# Altium project OK6010_DB.PrjPcb (part 2 of 2)

## Sheet OK6010_DB_DAC_f.SchDoc
size 260 x 195 mm; PageSetup: Record=PageOptions|CenterHorizontal=True|CenterVertical=True|PrintScale=1.02|XCorrection=1.00|YCorrection=1.00|PrintKind=2|BorderSize=5000000|LeftOffset=0|BottomOffset=0|Orientation=2|PaperLength=1000|PaperWidth=1000|Scale=100|PaperSource=15|PrintQuality=600|MediaType=1|DitherType=10|PaperKind=Letter|PrintScaleMode=1
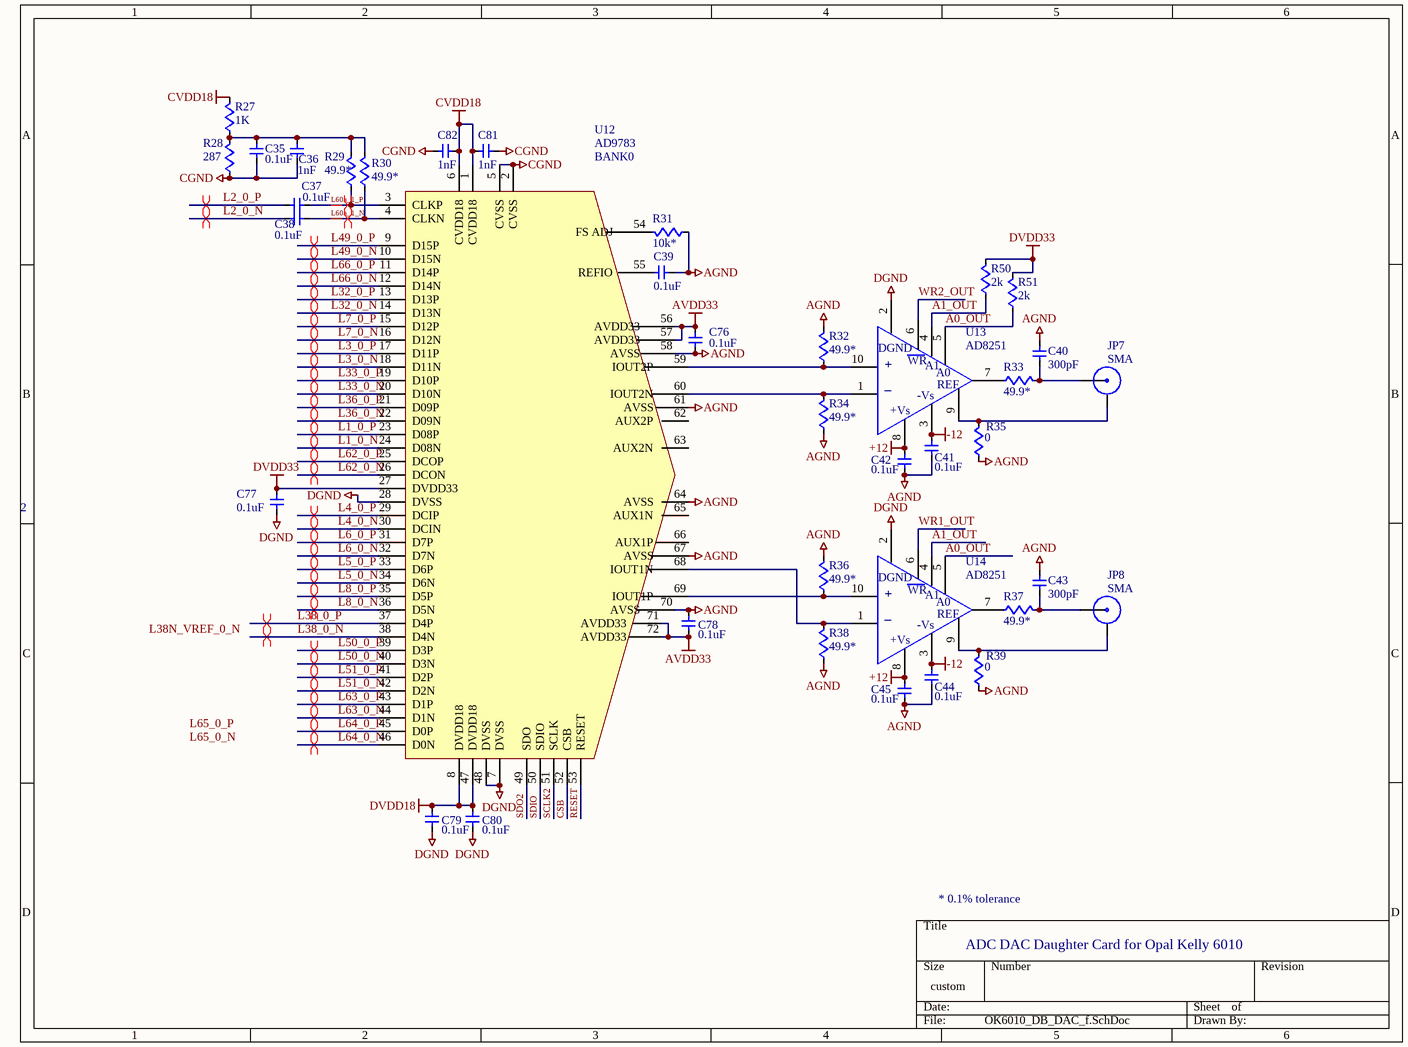
[diagram p3: OK6010_DB_DAC_f.SchDoc]

### Parts
C35  0.1uF  [0603w]
C36  1nF  [0603w]
C37  0.1uF  [1206]
C38  0.1uF  [1206]
C39  0.1uF  [0603w]
C40  300pF  [0603w]
C41  0.1uF  [0603w]
C42  0.1uF  [0603w]
C43  300pF  [0603w]
C44  0.1uF  [0603w]
C45  0.1uF  [0603w]
C76  0.1uF  [0603w]
C77  0.1uF  [0603w]
C78  0.1uF  [0603w]
C79  0.1uF  [0603w]
C80  0.1uF  [0603w]
C81  1nF  [0603w]
C82  1nF  [0603w]
JP7  SMA  [sma_pcb_200]
JP8  SMA  [sma_pcb_200]
R27  1K  [0603w]
R28  287  [0603w]
R29  49.9*  [0603w]
R30  49.9*  [0603w]
R31  10k*  [0603w]
R32  49.9*  [0603w]
R33  49.9*  [0603w]
R34  49.9*  [0603w]
R35  0  [0603w]
R36  49.9*  [0603w]
R37  49.9*  [0603w]
R38  49.9*  [0603w]
R39  0  [0603w]
R50  2k  [0603w]
R51  2k  [0603w]
U12  AD9783  [LFCSP72]
U13  AD8251  [MSOP10sm]
U14  AD8251  [MSOP10sm]

### Nets
+12: C42.2 C45.2 U13.8 U14.8
-12: C41.2 C44.2 U13.3 U14.3
AGND: C35.2 C36.2 C39.2 C40.2 C41.1 C42.1 C43.2 C44.1 C45.1 C76.1 C77.2 C78.2 C79.1 C80.1 C81.2 C82.2 R28.1 R31.1 R32.2 R34.1 R35.1 R36.2 R38.1 R39.1 U12.2(CVSS) U12.5(CVSS) U12.7(DVSS) U12.28(DVSS) U12.48(DVSS) U12.58(AVSS) U12.61(AVSS) U12.64(AVSS) U12.67(AVSS) U12.70(AVSS) U13.2 U14.2  [also labelled CGND, DGND]
AVDD33: C76.2 C78.1 U12.56(AVDD33) U12.57(AVDD33) U12.71(AVDD33) U12.72(AVDD33)
CVDD18: C81.1 C82.1 R27.2 U12.1(CVDD18) U12.6(CVDD18)
DVDD18: C79.2 C80.2 U12.8(DVDD18) U12.47(DVDD18)
DVDD33: C77.1 R50.2 R51.2 U12.27(DVDD33)
A0_OUT: R51.1 U13.5 U14.5
A1_OUT: R50.1 U13.4 U14.4
CSB: U12.52(CSB)
L1_0_N: U12.24(D08N)
L1_0_P: U12.23(D08P)
L2_0_N: C38.1
L2_0_P: C37.1
L3_0_N: U12.18(D11N)
L3_0_P: U12.17(D11P)
L4_0_N: U12.30(DCIN)
L4_0_P: U12.29(DCIP)
L5_0_N: U12.34(D6N)
L5_0_P: U12.33(D6P)
L6_0_N: U12.32(D7N)
L6_0_P: U12.31(D7P)
L7_0_N: U12.16(D12N)
L7_0_P: U12.15(D12P)
L8_0_N: U12.36(D5N)
L8_0_P: U12.35(D5P)
L32_0_N: U12.14(D13N)
L32_0_P: U12.13(D13P)
L33_0_N: U12.20(D10N)
L33_0_P: U12.19(D10P)
L36_0_N: U12.22(D09N)
L36_0_P: U12.21(D09P)
L38_0_N: U12.38(D4N)
L38_0_P: U12.37(D4P)
L49_0_N: U12.10(D15N)
L49_0_P: U12.9(D15P)
L50_0_N: U12.40(D3N)
L50_0_P: U12.39(D3P)
L51_0_N: U12.42(D2N)
L51_0_P: U12.41(D2P)
L60a_1_N: C38.2 R30.1 U12.4(CLKN)
L60a_1_P: C37.2 R29.1 U12.3(CLKP)
L62_0_N: U12.26(DCON)
L62_0_P: U12.25(DCOP)
L63_0_N: U12.44(D1N)
L63_0_P: U12.43(D1P)
L64_0_N: U12.46(D0N)
L64_0_P: U12.45(D0P)
L66_0_N: U12.12(D14N)
L66_0_P: U12.11(D14P)
RESET: U12.53(RESET)
SCLK2: U12.51(SCLK)
SDIO: U12.50(SDIO)
SDO2: U12.49(SDO)
WR1_OUT: U14.6
WR2_OUT: U13.6
NetC35_1: C35.1 C36.1 R27.1 R28.2 R29.2 R30.2
NetC39_1: C39.1 U12.55(REFIO)
NetC40_1: C40.1 JP7.1(signal) R33.2
NetC43_1: C43.1 JP8.1(signal) R37.2
NetJP7_0: JP7.0(ground) R35.2 U13.9
NetJP8_0: JP8.0(ground) R39.2 U14.9
NetR31_2: R31.2 U12.54(FS_ADJ)
NetR32_1: R32.1 U12.59(IOUT2P) U13.10
NetR33_1: R33.1 U13.7
NetR34_2: R34.2 U12.60(IOUT2N) U13.1
NetR36_1: R36.1 U12.69(IOUT1P) U14.10
NetR37_1: R37.1 U14.7
NetR38_2: R38.2 U12.68(IOUT1N) U14.1

Not connected (* = marked no-connect by the designer): U12 62(AUX2P) 63(AUX2N) 65(AUX1N) 66(AUX1P)

### Layout directives
differential pair: L1_0_N, L1_0_P, L2_0_N, L2_0_P, L3_0_N, L3_0_P, L4_0_N, L4_0_P, L5_0_N, L5_0_P, L6_0_N, L6_0_P, L7_0_N, L7_0_P, L8_0_N, L8_0_P, L32_0_N, L32_0_P, L33_0_N, L33_0_P, L36_0_N, L36_0_P, L38_0_N, L38_0_P, L49_0_N, L49_0_P, L50_0_N, L50_0_P, L51_0_N, L51_0_P, L60a_1_N, L60a_1_P, L62_0_N, L62_0_P, L63_0_N, L63_0_P, L64_0_N, L64_0_P, L66_0_N, L66_0_P

### Notes on the sheet
- (near U12) BANK0
- 2
- * 0.1% tolerance
- ADC DAC Daughter Card for Opal Kelly 6010
- Labels drawn without touching a wire or pin: L38N_VREF_0_N, L65_0_N, L65_0_P
- (in symbol AD8251) DGND; WR; +; A1; A0; _; REF; -Vs; +Vs

### Library data of the parts
C35 C39 C41 C42 C44 C45 C76-C80 = CAP_SM_1: capacitor; Manufacturer: Kemet; Manufacturer Part Number: C0603C104K3RACTU; Capacitance: 0.1µF; Temperature Coefficient: X7R; Tolerance: ±10%; Voltage - Rated: 25V; Applications: General Purpose; Category: Capacitors; ComponentLink1Description: http://www.kemet.com/datasheets&C0603C104K3RACTU; ComponentLink1URL: http://www.kemet.com/datasheets&C0603C104K3RACTU; Features: -; Lead Spacing: -; Lead Style: -; Mounting Type: Surface Mount, MLCC; Operating Temperature: -55°C ~ 125°C; Package / Case: 0603 (1608 Metric); Packaging: Cut Tape (CT); Pricing 1: 10=0.075, 100=0.027, 250=0.01952, 500=0.0144, 1000=0.00975 (USD); Ratings: -; RoHS: RoHS Compliant; Size / Dimension: 0.063" L x 0.032" W (1.60mm x 0.80mm); Stock 1: 2338960; Supplier 1: Digi-Key; Supplier Part Number 1: 399-1281-1-ND; Thickness: 0.80mm
C36 C81 C82 = CAP_SM_1: capacitor; Manufacturer: Murata Electronics North America; Manufacturer Part Number: GRM188R71H102KA01D; Description: CAP CER 1000PF 50V 10% X7R 0603; Capacitance: 1000pF; Voltage - Rated: 50V; Tolerance: ±10%; Temperature Coefficient: X7R; Supplier 1: Digi-Key; Supplier Part Number 1: 490-1494-1-ND; RoHS: RoHS Compliant; Category: Capacitors; Stock 1: 512721; Pricing 1: 1=0.07, 10=0.043, 50=0.0204, 100=0.0153, 250=0.01104, 500=0.00816, 1000=0.00553 (USD); Mounting Type: Surface Mount, MLCC; Operating Temperature: -55°C ~ 125°C; Applications: General Purpose; Ratings: -; Package / Case: 0603 (1608 Metric); Size / Dimension: 0.063" L x 0.031" W (1.60mm x 0.80mm); Height: -; Thickness: 0.035" (0.90mm); Lead Spacing: -; Features: -; Packaging: Cut Tape (CT); Lead Style: -; ComponentLink1URL: http://search.murata.co.jp/Ceramy/image/img/PDF/ENG/GRM188R71H102KA01.pdf; ComponentLink1Description: http://search.murata.co.jp/Ceramy/image/img/PDF/ENG/GRM188R71H102KA01.pdf
C37 C38 = CAP_SM_1: capacitor; Manufacturer: Murata Electronics North America; Manufacturer Part Number: GRM31C5C1E104JA01L; Description: CAP CER .1UF 25V 5% C0G 1206; Capacitance: 0.1µF; Voltage - Rated: 25V; Tolerance: ±5%; Temperature Coefficient: C0G, NP0; Supplier 1: Digi-Key; Supplier Part Number 1: 490-1767-1-ND; RoHS: RoHS Compliant; Category: Capacitors; Stock 1: 374793; Pricing 1: 1=0.57, 10=0.48, 50=0.3436, 100=0.3007, 250=0.23628, 500=0.2148, 1000=0.17184 (USD); Mounting Type: Surface Mount, MLCC; Operating Temperature: -55°C ~ 125°C; Applications: General Purpose; Ratings: -; Package / Case: 1206 (3216 Metric); Size / Dimension: 0.126" L x 0.063" W (3.20mm x 1.60mm); Height: -; Thickness: 0.071" (1.80mm); Lead Spacing: -; Features: -; Packaging: Cut Tape (CT); Lead Style: -; ComponentLink1URL: http://search.murata.co.jp/Ceramy/image/img/PDF/ENG/GRM31C5C1E104JA01.pdf; ComponentLink1Description: http://search.murata.co.jp/Ceramy/image/img/PDF/ENG/GRM31C5C1E104JA01.pdf
C40 C43 = CAP_SM_1: capacitor; Supplier 1: Digi-Key; Supplier Part Number 1: 490-1438-1-ND
JP7 = SMA_EDGE: sma connector; Manufacturer: TE Connectivity; Manufacturer Part Number: 5-1814832-1; Description: CONN SOCKET SMA STR DIE CAST PCB; Connector Type: Jack, Female Sockets; Contact Termination: Solder; Impedance: 50 Ohm; Frequency - Max: 3GHz; Supplier 1: Digi-Key; Supplier Part Number 1: A97594-ND; RoHS: RoHS Compliant; Category: Connectors, Interconnects; Stock 1: 22563; Pricing 1: 1=2.7, 25=2.322, 50=2.052, 100=1.836, 250=1.62, 500=1.4364 (USD); Connector Style: SMA; Mounting Type: Through Hole; Fastening Type: Threaded; Cable Group: -; Features: -; Color: -; Packaging: Bulk; ComponentLink1URL: http://documents.tycoelectronics.com/commerce/DocumentDelivery/DDEController?Action=srchrtrv&DocNm=1814832&DocType=CD&DocLang=EN; ComponentLink1Description: http://documents.tycoelectronics.com/commerce/DocumentDelivery/DDEController?Action=srchrtrv&DocNm=1814832&DocType=CD&DocLang=EN
JP8 = SMA_EDGE: sma connector; Manufacturer: TE Connectivity; Manufacturer Part Number: 5-1814832-1; Connector Type: Jack, Female Sockets; Contact Termination: Solder; Frequency - Max: 3GHz; Impedance: 50 Ohm; Cable Group: -; Category: Connectors, Interconnects; Color: -; ComponentLink1Description: http://documents.tycoelectronics.com/commerce/DocumentDelivery/DDEController?Action=srchrtrv&DocNm=1814832&DocType=CD&DocLang=EN; ComponentLink1URL: http://documents.tycoelectronics.com/commerce/DocumentDelivery/DDEController?Action=srchrtrv&DocNm=1814832&DocType=CD&DocLang=EN; Connector Style: SMA; Fastening Type: Threaded; Features: -; Mounting Type: Through Hole; Packaging: Bulk; Pricing 1: 1=2.7, 25=2.322, 50=2.052, 100=1.836, 250=1.62, 500=1.4364 (USD); RoHS: RoHS Compliant; Stock 1: 22563; Supplier 1: Digi-Key; Supplier Part Number 1: A97594-ND
R27 = RES_SM: resistor; Manufacturer: Yageo; Manufacturer Part Number: RC0603FR-071KL; Description: RES 1.00K OHM 1/10W 1% 0603 SMD; Power (Watts): 0.1W, 1/10W; Temperature Coefficient: ±100ppm/°C; Tolerance: ±1%; Supplier 1: Digi-Key; Supplier Part Number 1: 311-1.00KHRCT-ND; RoHS: RoHS Compliant; Category: Resistors; Stock 1: 4416298; Pricing 1: 10=0.014, 50=0.0104, 100=0.0079, 250=0.00584, 500=0.00432, 1000=0.00288 (USD); Resistance (Ohms): 1K; Composition: Thick Film; Features: -; Size / Dimension: 0.063" L x 0.031" W (1.60mm x 0.80mm); Height: 0.018" (0.45mm); Number of Terminations: 2; Packaging: Cut Tape (CT); Package / Case: 0603 (1608 Metric); ComponentLink1URL: http://www.yageo.com/documents/recent/PYu-RC0603_51_RoHS_L_4.pdf; ComponentLink1Description: http://www.yageo.com/documents/recent/PYu-RC0603_51_RoHS_L_4.pdf
R28 = RES_SM: resistor; Manufacturer: Yageo; Manufacturer Part Number: RC0603FR-07287RL; Description: RES 287 OHM 1/10W 1% 0603 SMD; Power (Watts): 0.1W, 1/10W; Temperature Coefficient: ±100ppm/°C; Tolerance: ±1%; Supplier 1: Digi-Key; Supplier Part Number 1: 311-287HRCT-ND; RoHS: RoHS Compliant; Category: Resistors; Stock 1: 82528; Pricing 1: 10=0.014, 50=0.0104, 100=0.0079, 250=0.00584, 500=0.00432, 1000=0.00288 (USD); Resistance (Ohms): 287; Composition: Thick Film; Features: -; Size / Dimension: 0.063" L x 0.031" W (1.60mm x 0.80mm); Height: 0.018" (0.45mm); Number of Terminations: 2; Packaging: Cut Tape (CT); Package / Case: 0603 (1608 Metric); ComponentLink1URL: http://www.yageo.com/documents/recent/PYu-RC0603_51_RoHS_L_4.pdf; ComponentLink1Description: http://www.yageo.com/documents/recent/PYu-RC0603_51_RoHS_L_4.pdf
R29 R30 R32-R34 R36-R38 = RES_SM: resistor; Manufacturer: Stackpole Electronics Inc; Manufacturer Part Number: RNCS0603BKE49R9; Description: RES 1/16W 49.9 OHM 0.1% 0603; Resistance (Ohms): 49.9; Power (Watts): 0.063W, 1/16W; Temperature Coefficient: ±25ppm/°C; Tolerance: ±0.1%; Supplier 1: Digi-Key; Supplier Part Number 1: RNCS0603BKE49R9CT-ND; RoHS: RoHS Compliant; Category: Resistors; Stock 1: 13782; Pricing 1: 1=0.7, 10=0.475, 50=0.2876, 100=0.2375, 250=0.18752, 500=0.16 (USD); Composition: Thin Film; Features: Anti-Corrosive, Moisture Resistant; Size / Dimension: 0.061" L x 0.031" W (1.55mm x 0.80mm); Height: 0.018" (0.45mm); Number of Terminations: 2; Packaging: Cut Tape (CT); Package / Case: 0603 (1608 Metric); ComponentLink1URL: http://www.seielect.com/Catalog/SEI-rncs.pdf; ComponentLink1Description: http://www.seielect.com/Catalog/SEI-rncs.pdf
R31 = RES_SM: resistor; Manufacturer: Susumu; Manufacturer Part Number: RG1608P-103-B-T5; Description: RES 10.0K OHM 1/10W .1% 0603 SMD; Resistance (Ohms): 10K; Power (Watts): 0.1W, 1/10W; Temperature Coefficient: ±25ppm/°C; Tolerance: ±0.1%; Supplier 1: Digi-Key; Supplier Part Number 1: RG16P10.0KBCT-ND; RoHS: RoHS Compliant; Category: Resistors; Stock 1: 368390; Pricing 1: 10=0.409, 50=0.2478, 200=0.2047, 1000=0.10342 (USD); Composition: Thin Film; Features: -; Size / Dimension: 0.063" L x 0.031" W (1.60mm x 0.80mm); Height: 0.016" (0.40mm); Number of Terminations: 2; Packaging: Cut Tape (CT); Package / Case: 0603 (1608 Metric); ComponentLink1URL: http://www.susumu-usa.com/pdf/RG_RM_RGH_DATASHEET.pdf; ComponentLink1Description: http://www.susumu-usa.com/pdf/RG_RM_RGH_DATASHEET.pdf
R35 R39 = RES_SM: resistor; Supplier 1: Digi-Key; Supplier Part Number 1: P0.0GCT-ND
R50 R51 = RES_SM: resistor; Manufacturer: Yageo; Manufacturer Part Number: RC0603FR-072KL; Power (Watts): 0.1W, 1/10W; Temperature Coefficient: ±100ppm/°C; Tolerance: ±1%; Description: RES 2.00K OHM 1/10W 1% 0603 SMD; Category: Resistors; ComponentLink1Description: http://www.yageo.com/documents/recent/PYu-RC0603_51_RoHS_L_4.pdf; ComponentLink1URL: http://www.yageo.com/documents/recent/PYu-RC0603_51_RoHS_L_4.pdf; Composition: Thick Film; Features: -; Height: 0.018" (0.45mm); Number of Terminations: 2; Package / Case: 0603 (1608 Metric); Packaging: Cut Tape (CT); Pricing 1: 10=0.014, 50=0.0104, 100=0.0079, 250=0.00584, 500=0.00432, 1000=0.00288 (USD); Resistance (Ohms): 2K; RoHS: RoHS Compliant; Size / Dimension: 0.063" L x 0.031" W (1.60mm x 0.80mm); Stock 1: 1129886; Supplier 1: Digi-Key; Supplier Part Number 1: 311-2.00KHRCT-ND
U12 = AD9783: DAC LVDS DUAL16BIT 500MSPS; Supplier 1: Digi-Key; Supplier Part Number 1: AD9783BCPZ-ND
U13 U14 = AD8251: IC AMP INST ICMOS LDRIFT 10MSOP; Supplier 1: Digi-Key; Supplier Part Number 1: AD8251ARMZ-ND

## Sheet OK6010_DB_PWR.SchDoc
size 260 x 195 mm
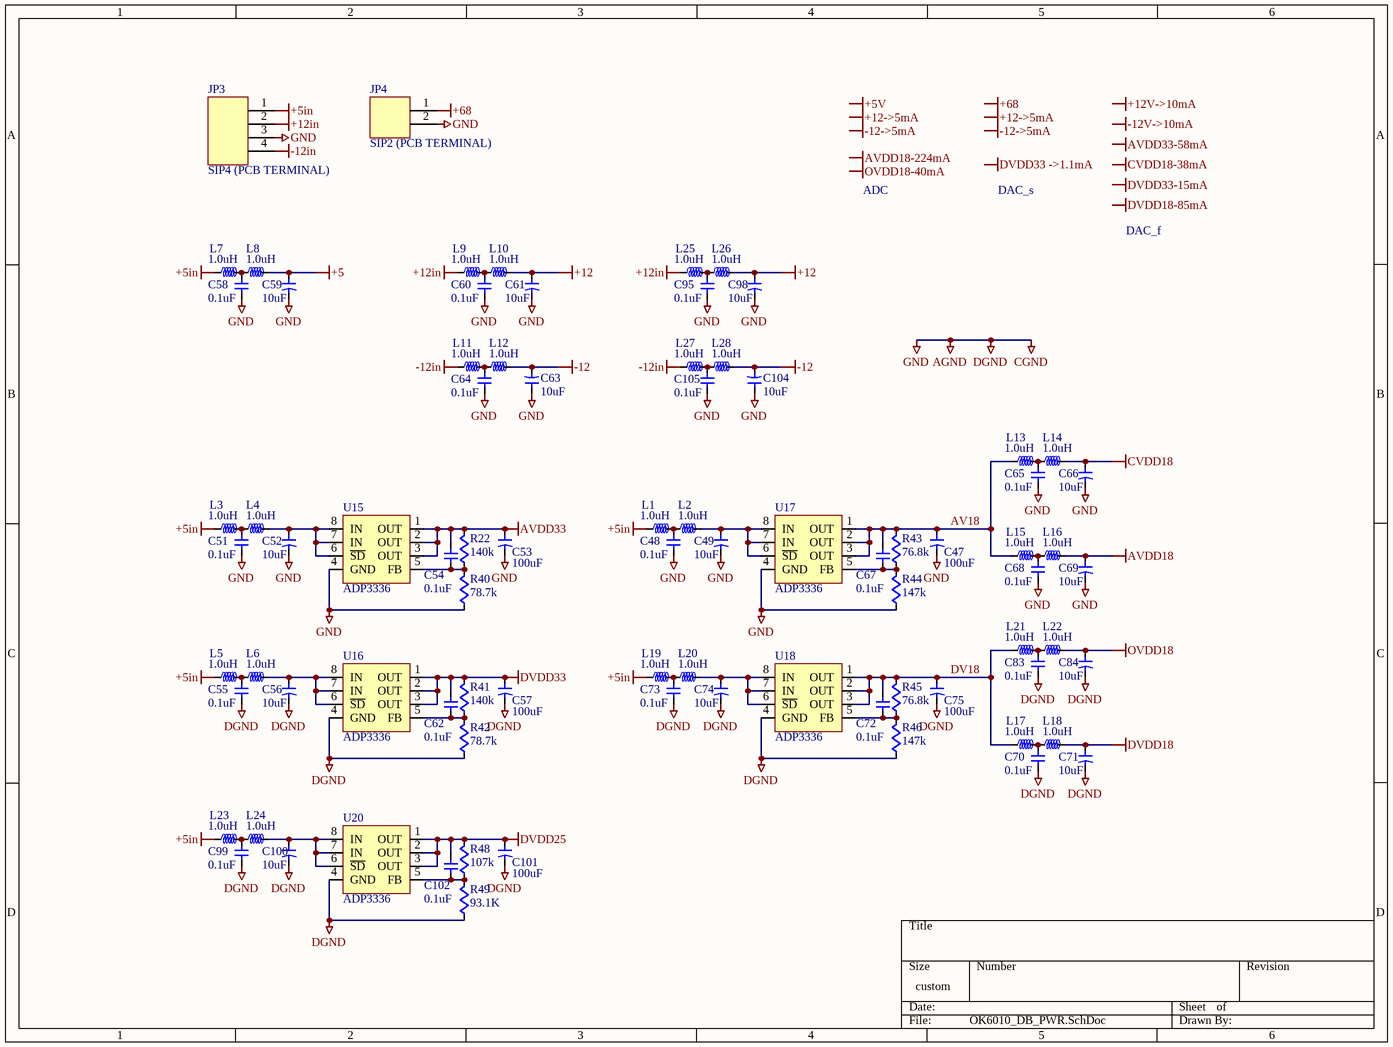
[diagram p4: OK6010_DB_PWR.SchDoc]

### Parts
C47  100uF  [1206]
C48  0.1uF  [0603w]
C49  10uF  [1206]
C51  0.1uF  [0603w]
C52  10uF  [1206]
C53  100uF  [1206]
C54  0.1uF  [0603w]
C55  0.1uF  [0603w]
C56  10uF  [1206]
C57  100uF  [1206]
C58  0.1uF  [0603w]
C59  10uF  [1206]
C60  0.1uF  [0603w]
C61  10uF  [1206]
C62  0.1uF  [0603w]
C63  10uF  [1206]
C64  0.1uF  [0603w]
C65  0.1uF  [0603w]
C66  10uF  [1206]
C67  0.1uF  [0603w]
C68  0.1uF  [0603w]
C69  10uF  [1206]
C70  0.1uF  [0603w]
C71  10uF  [1206]
C72  0.1uF  [0603w]
C73  0.1uF  [0603w]
C74  10uF  [1206]
C75  100uF  [1206]
C83  0.1uF  [0603w]
C84  10uF  [1206]
C95  0.1uF  [0603w]
C98  10uF  [1206]
C99  0.1uF  [0603w]
C100  10uF  [1206]
C101  100uF  [1206]
C102  0.1uF  [0603w]
C104  10uF  [1206]
C105  0.1uF  [0603w]
JP3  SIP4 (PCB TERMINAL)  [SIP4MOLEX]
JP4  SIP2 (PCB TERMINAL)  [SIP2MOLEX]
L1  1.0uH  [1210]
L2  1.0uH  [1210]
L3  1.0uH  [0805]
L4  1.0uH  [0805]
L5  1.0uH  [0805]
L6  1.0uH  [0805]
L7  1.0uH  [1210]
L8  1.0uH  [1210]
L9  1.0uH  [1210]
L10  1.0uH  [1210]
L11  1.0uH  [1210]
L12  1.0uH  [1210]
L13  1.0uH  [0805]
L14  1.0uH  [0805]
L15  1.0uH  [1210]
L16  1.0uH  [1210]
L17  1.0uH  [0805]
L18  1.0uH  [0805]
L19  1.0uH  [0805]
L20  1.0uH  [0805]
L21  1.0uH  [0805]
L22  1.0uH  [0805]
L23  1.0uH  [0805]
L24  1.0uH  [0805]
L25  1.0uH  [1210]
L26  1.0uH  [1210]
L27  1.0uH  [1210]
L28  1.0uH  [1210]
R22  140k  [0603w]
R40  78.7k  [0603w]
R41  140k  [0603w]
R42  78.7k  [0603w]
R43  76.8k  [0603w]
R44  147k  [0603w]
R45  76.8k  [0603w]
R46  147k  [0603w]
R48  107k  [0603w]
R49  93.1K  [0603w]
U15  ADP3336  [MSOP08]
U16  ADP3336  [MSOP08]
U17  ADP3336  [MSOP08]
U18  ADP3336  [MSOP08]
U20  ADP3336  [MSOP08]

### Nets
+5: C59.1 L8.2
+5in: JP3.1 L1.1 L3.1 L5.1 L7.1 L19.1 L23.1
+12: C61.1 C98.1 L10.2 L26.2
+12in: JP3.2 L9.1 L25.1
+68: JP4.1
-12: C63.2 C104.2 L12.2 L28.2
-12in: JP3.4 L11.1 L27.1
AGND: C47.2 C48.2 C49.2 C51.2 C52.2 C53.2 C55.2 C56.2 C57.2 C58.2 C59.2 C60.2 C61.2 C63.1 C64.2 C65.2 C66.2 C68.2 C69.2 C70.2 C71.2 C73.2 C74.2 C75.2 C83.2 C84.2 C95.2 C98.2 C99.2 C100.2 C101.2 C104.1 C105.2 JP3.3 JP4.2 R40.1 R42.1 R44.1 R46.1 R49.1 U15.4(GND) U16.4(GND) U17.4(GND) U18.4(GND) U20.4(GND)  [also labelled CGND, DGND, GND]
AVDD18: C69.1 L16.2
AVDD33: C53.1 C54.1 R22.2 U15.1(OUT) U15.2(OUT) U15.3(OUT)
CVDD18: C66.1 L14.2
DVDD18: C71.1 L18.2
DVDD25: C101.1 C102.1 R48.2 U20.1(OUT) U20.2(OUT) U20.3(OUT)
DVDD33: C57.1 C62.1 R41.2 U16.1(OUT) U16.2(OUT) U16.3(OUT)
OVDD18: C84.1 L22.2
AV18: C47.1 C67.1 L13.1 L15.1 R43.2 U17.1(OUT) U17.2(OUT) U17.3(OUT)
DV18: C72.1 C75.1 L17.1 L21.1 R45.2 U18.1(OUT) U18.2(OUT) U18.3(OUT)
NetC48_1: C48.1 L1.2 L2.1
NetC49_1: C49.1 L2.2 U17.6(~{SD}) U17.7(IN) U17.8(IN)
NetC51_1: C51.1 L3.2 L4.1
NetC52_1: C52.1 L4.2 U15.6(~{SD}) U15.7(IN) U15.8(IN)
NetC54_2: C54.2 R22.1 R40.2 U15.5(FB)
NetC55_1: C55.1 L5.2 L6.1
NetC56_1: C56.1 L6.2 U16.6(~{SD}) U16.7(IN) U16.8(IN)
NetC58_1: C58.1 L7.2 L8.1
NetC60_1: C60.1 L9.2 L10.1
NetC62_2: C62.2 R41.1 R42.2 U16.5(FB)
NetC64_1: C64.1 L11.2 L12.1
NetC65_1: C65.1 L13.2 L14.1
NetC67_2: C67.2 R43.1 R44.2 U17.5(FB)
NetC68_1: C68.1 L15.2 L16.1
NetC70_1: C70.1 L17.2 L18.1
NetC72_2: C72.2 R45.1 R46.2 U18.5(FB)
NetC73_1: C73.1 L19.2 L20.1
NetC74_1: C74.1 L20.2 U18.6(~{SD}) U18.7(IN) U18.8(IN)
NetC83_1: C83.1 L21.2 L22.1
NetC95_1: C95.1 L25.2 L26.1
NetC99_1: C99.1 L23.2 L24.1
NetC100_1: C100.1 L24.2 U20.6(~{SD}) U20.7(IN) U20.8(IN)
NetC102_2: C102.2 R48.1 R49.2 U20.5(FB)
NetC105_1: C105.1 L27.2 L28.1

### Notes on the sheet
- ADC
- DAC_s
- DAC_f
- Labels drawn without touching a wire or pin: +5V, +12->5mA, +12V->10mA, +68, -12->5mA, -12V->10mA, AVDD18-224mA, AVDD33-58mA, CVDD18-38mA, DVDD18-85mA, DVDD33 ->1.1mA, DVDD33-15mA, OVDD18-40mA

### Library data of the parts
C47 C53 C57 C75 C101 = CAPACITOR_SM: capacitor; Manufacturer: TDK Corporation; Manufacturer Part Number: C3216X5R0J107M; Description: CAP CER 100UF 6.3V X5R 20% 1206; Capacitance: 100µF; Voltage - Rated: 6.3V; Tolerance: ±20%; Temperature Coefficient: X5R; Supplier 1: Digi-Key; Supplier Part Number 1: 445-6008-1-ND; RoHS: RoHS Compliant; Category: Capacitors; Stock 1: 10697; Pricing 1: 1=1.24, 10=1.034, 100=0.759, 250=0.66, 500=0.616, 1000=0.484 (USD); Mounting Type: Surface Mount, MLCC; Operating Temperature: -55°C ~ 85°C; Applications: General Purpose; Ratings: -; Package / Case: 1206 (3216 Metric); Size / Dimension: 0.126" L x 0.063" W (3.20mm x 1.60mm); Height: -; Thickness: 0.071" (1.80mm); Lead Spacing: -; Features: Low ESR; Packaging: Cut Tape (CT); Lead Style: -; ComponentLink1URL: http://www.tdk.com/pdf/general_A11.pdf; ComponentLink1Description: http://www.tdk.com/pdf/general_A11.pdf
C48 C51 C54 C55 C58 C60 C62 C64 C65 C67 C68 C70 C72 C73 C83 C95 C99 C102 C105 = CAP_SM: capacitor; Manufacturer: Kemet; Manufacturer Part Number: C0603C104K3RACTU; Capacitance: 0.1µF; Temperature Coefficient: X7R; Tolerance: ±10%; Voltage - Rated: 25V; Applications: General Purpose; Category: Capacitors; ComponentLink1Description: http://www.kemet.com/datasheets&C0603C104K3RACTU; ComponentLink1URL: http://www.kemet.com/datasheets&C0603C104K3RACTU; Features: -; Lead Spacing: -; Lead Style: -; Mounting Type: Surface Mount, MLCC; Operating Temperature: -55°C ~ 125°C; Package / Case: 0603 (1608 Metric); Packaging: Cut Tape (CT); Pricing 1: 10=0.075, 100=0.027, 250=0.01952, 500=0.0144, 1000=0.00975 (USD); Ratings: -; RoHS: RoHS Compliant; Size / Dimension: 0.063" L x 0.032" W (1.60mm x 0.80mm); Stock 1: 2338960; Supplier 1: Digi-Key; Supplier Part Number 1: 399-1281-1-ND; Thickness: 0.80mm
C49 C52 C56 C59 C61 C63 C66 C69 C71 C74 C84 C100 C104 = CAPACITOR_SM: ELECTROLYTIC capacitor; Manufacturer: Nichicon; Manufacturer Part Number: F971C106MAA; Manufacturer Size Code: A; Capacitance: 10µF; Temperature Coefficient: X5R; Tolerance: ±20%; Voltage - Rated: 16V; ESR (Equivalent Series Resistance): 3.500 Ohm; Type: Molded; Applications: General Purpose; Category: Capacitors; ComponentLink1Description: http://nichicon-us.com/english/products/pdf/e-f97.pdf; ComponentLink1URL: http://nichicon-us.com/english/products/pdf/e-f97.pdf; Features: High Reliability; Height: 0.071" (1.80mm); Lead Spacing: -; Lead Style: -; Mounting Type: Surface Mount; Operating Temperature: -55°C ~ 125°C; Package / Case: 1206 (3216 Metric); Packaging: Cut Tape (CT); Pricing 1: 1=0.5, 10=0.398, 100=0.24, 250=0.18, 500=0.1536, 1000=0.12 (USD); Ratings: -; RoHS: RoHS Compliant; Size / Dimension: 0.126" L x 0.063" W (3.20mm x 1.60mm); Stock 1: 885; Supplier 1: Digi-Key; Supplier Part Number 1: 493-4304-1-ND; Thickness: 0.071" (1.80mm); Lifetime @ Temp.: -
C98 = CAPACITOR_SM: ELECTROLYTIC capacitor; Manufacturer: Nichicon; Manufacturer Part Number: F971C106MAA; Manufacturer Size Code: A; Description: CAP CER 10UF 16V X5R 20% 1206; Capacitance: 10µF; Voltage - Rated: 16V; Tolerance: ±20%; Temperature Coefficient: X5R; ESR (Equivalent Series Resistance): 3.500 Ohm; Type: Molded; Supplier 1: Digi-Key; Supplier Part Number 1: 493-4304-1-ND; RoHS: RoHS Compliant; Category: Capacitors; Stock 1: 885; Pricing 1: 1=0.5, 10=0.398, 100=0.24, 250=0.18, 500=0.1536, 1000=0.12 (USD); Mounting Type: Surface Mount; Operating Temperature: -55°C ~ 125°C; Applications: General Purpose; Ratings: -; Package / Case: 1206 (3216 Metric); Size / Dimension: 0.126" L x 0.063" W (3.20mm x 1.60mm); Height: 0.071" (1.80mm); Thickness: 0.071" (1.80mm); Lead Spacing: -; Features: High Reliability; Packaging: Cut Tape (CT); Lead Style: -; ComponentLink1URL: http://nichicon-us.com/english/products/pdf/e-f97.pdf; ComponentLink1Description: http://nichicon-us.com/english/products/pdf/e-f97.pdf; Lifetime @ Temp.: -
JP3 = SIP4 (PCB TERMINAL): 4 pin molex connector; Manufacturer: Molex Inc; Description: CONN HEADER 4POS .100 VERT GOLD; Connector Type: Header, Unshrouded; Number of Positions: 4; Number of Positions Loaded: All; Pitch: 0.100" (2.54mm); Supplier 1: Digi-Key; Supplier Part Number 1: WM2746-ND; Manufacturer Part Number: 22-29-2041; RoHS: RoHS Compliant; Category: Connectors, Interconnects; Stock 1: 6126; Pricing 1: 1=0.95, 10=0.664, 50=0.5124, 100=0.446, 250=0.3796, 500=0.36062, 1000=0.32266, 2500=0.25623, 5000=0.25243 (USD); Contact Type: Male Pin; Number of Rows: 1; Row Spacing: -; Contact Mating Length: 0.295" (7.49mm); Mounting Type: Through Hole; Termination: Solder; Fastening Type: Friction Lock; Features: -; Contact Finish: Gold; Contact Finish Thickness: 20µin (0.51µm); Color: White; Packaging: Bulk; ComponentLink1URL: http://www.molex.com/pdm_docs/sd/022292041_sd.pdf; ComponentLink1Description: http://www.molex.com/pdm_docs/sd/022292041_sd.pdf
JP4 = SIP2 (PCB TERMINAL): 2 pin molex connector; Manufacturer: Molex Inc; Description: CONN HEADER 2POS .100 VERT GOLD; Connector Type: Header, Unshrouded; Number of Positions: 2; Number of Positions Loaded: All; Pitch: 0.100" (2.54mm); Supplier 1: Digi-Key; Supplier Part Number 1: WM2744-ND; Manufacturer Part Number: 22-29-2021; RoHS: RoHS Compliant; Category: Connectors, Interconnects; Stock 1: 10214; Pricing 1: 1=0.65, 10=0.456, 50=0.3518, 100=0.3062, 250=0.2606, 500=0.24758, 1000=0.22151, 2500=0.1759, 5000=0.1733 (USD); Contact Type: Male Pin; Number of Rows: 1; Row Spacing: -; Contact Mating Length: 0.295" (7.49mm); Mounting Type: Through Hole; Termination: Solder; Fastening Type: Friction Lock; Features: -; Contact Finish: Gold; Contact Finish Thickness: 20µin (0.51µm); Color: White; Packaging: Bulk; ComponentLink1URL: http://www.molex.com/pdm_docs/sd/022292021_sd.pdf; ComponentLink1Description: http://www.molex.com/pdm_docs/sd/022292021_sd.pdf
L1 L7 L9 L11 L15 L25 L27 = INDUCTOR_SM: inductor; Manufacturer: Murata Electronics North America; Manufacturer Part Number: LQH32CN1R0M23L; Current: 800mA; DC Resistance (DCR): 117 mOhm Max; Frequency - Test: 1MHz; Inductance: 1µH; Self Resonant Freq: 96MHz; Shielding: Unshielded; Tolerance: ±20%; Type: Ferrite Core; Description: INDUCTOR 1.0UH 20% 800MA 1210; Material - Core: Ferrite; Applications: Power Supplies; Category: Inductors, Coils, Chokes; ComponentLink1Description: http://search.murata.co.jp/Ceramy/image/img/PDF/ENG/L0075S0093LQH32C_23~33.pdf; ComponentLink1URL: http://search.murata.co.jp/Ceramy/image/img/PDF/ENG/L0075S0093LQH32C_23~33.pdf; Current - Saturation: -; Current - Temperature Rise: -; Mounting Type: Surface Mount; Operating Temperature: -40°C ~ 85°C; Package / Case: 1210 (3225 Metric); Packaging: Cut Tape (CT); Q @ Freq: -; RoHS: RoHS Compliant; Supplier 1: Digi-Key; Supplier Part Number 1: 490-2493-1-ND; Stock 1: 5265; Pricing 1: 1=0.27, 10=0.258, 50=0.2422, 100=0.2261, 500=0.17766, 1000=0.14535 (USD)
L2 L8 L10 L12 L16 L26 L28 = INDUCTOR_SM: inductor; Manufacturer: Murata Electronics North America; Manufacturer Part Number: LQH32CN1R0M23L; Description: INDUCTOR 1.0UH 20% 800MA 1210; Inductance: 1µH; Current: 800mA; Type: Ferrite Core; Tolerance: ±20%; Shielding: Unshielded; DC Resistance (DCR): 117 mOhm Max; Self Resonant Freq: 96MHz; Frequency - Test: 1MHz; Material - Core: Ferrite; RoHS: RoHS Compliant; Category: Inductors, Coils, Chokes; Current - Saturation: -; Current - Temperature Rise: -; Q @ Freq: -; Package / Case: 1210 (3225 Metric); Mounting Type: Surface Mount; Packaging: Cut Tape (CT); Operating Temperature: -40°C ~ 85°C; Applications: Power Supplies; ComponentLink1URL: http://search.murata.co.jp/Ceramy/image/img/PDF/ENG/L0075S0093LQH32C_23~33.pdf; ComponentLink1Description: http://search.murata.co.jp/Ceramy/image/img/PDF/ENG/L0075S0093LQH32C_23~33.pdf; Supplier 1: Digi-Key; Supplier Part Number 1: 490-2493-1-ND; Stock 1: 5265; Pricing 1: 1=0.27, 10=0.258, 50=0.2422, 100=0.2261, 500=0.17766, 1000=0.14535 (USD)
L3 L5 L13 L17 L19 L21 L23 = INDUCTOR_SM: inductor; Manufacturer: Murata Electronics North America; Manufacturer Part Number: LQM21FN1R0N00D; Current: 220mA; DC Resistance (DCR): 260 mOhm Max; Frequency - Test: 1MHz; Inductance: 1µH; Self Resonant Freq: 105MHz; Shielding: Shielded; Tolerance: ±30%; Description: INDUCTOR 1.0UH 20% 800MA 1210; Current - Saturation: -; Current - Temperature Rise: -; Mounting Type: Surface Mount; Operating Temperature: -40°C ~ 85°C; Package / Case: 0805 (2012 Metric); Packaging: Cut Tape (CT); Q @ Freq: -; RoHS: RoHS Compliant; Type: -; Supplier 1: Digi-Key; Supplier Part Number 1: 490-4026-1-ND; Stock 1: 0; Pricing 1: 1=0.11, 10=0.104, 50=0.0972, 100=0.0907, 500=0.07122, 1000=0.05828 (USD); Material - Core: -
L4 L6 L14 L18 L20 L22 L24 = INDUCTOR_SM: inductor; Manufacturer: Murata Electronics North America; Manufacturer Part Number: LQM21FN1R0N00D; Description: INDUCTOR 1.0UH 220MA 0805; Inductance: 1µH; Current: 220mA; Tolerance: ±30%; Shielding: Shielded; DC Resistance (DCR): 260 mOhm Max; Self Resonant Freq: 105MHz; Frequency - Test: 1MHz; RoHS: RoHS Compliant; Current - Saturation: -; Current - Temperature Rise: -; Type: -; Q @ Freq: -; Package / Case: 0805 (2012 Metric); Mounting Type: Surface Mount; Packaging: Cut Tape (CT); Operating Temperature: -40°C ~ 85°C; Supplier 1: Digi-Key; Supplier Part Number 1: 490-4026-1-ND; Stock 1: 0; Pricing 1: 1=0.11, 10=0.104, 50=0.0972, 100=0.0907, 500=0.07122, 1000=0.05828 (USD); Material - Core: -
R22 R41 = RES_SM: resistor; Manufacturer: Yageo; Manufacturer Part Number: RC0603FR-07140KL; Description: RES 140K OHM 1/10W 1% 0603 SMD; Power (Watts): 0.1W, 1/10W; Temperature Coefficient: ±100ppm/°C; Tolerance: ±1%; Supplier 1: Digi-Key; Supplier Part Number 1: 311-140KHRCT-ND; RoHS: RoHS Compliant; Category: Resistors; Stock 1: 612355; Pricing 1: 10=0.014, 50=0.0104, 100=0.0079, 250=0.00584, 500=0.00432, 1000=0.00288 (USD); Resistance (Ohms): 140K; Composition: Thick Film; Features: -; Size / Dimension: 0.063" L x 0.031" W (1.60mm x 0.80mm); Height: 0.018" (0.45mm); Number of Terminations: 2; Packaging: Cut Tape (CT); Package / Case: 0603 (1608 Metric); ComponentLink1URL: http://www.yageo.com/documents/recent/PYu-RC0603_51_RoHS_L_4.pdf; ComponentLink1Description: http://www.yageo.com/documents/recent/PYu-RC0603_51_RoHS_L_4.pdf
R40 R42 = RES_SM: resistor; Manufacturer: Yageo; Manufacturer Part Number: RC0603FR-0778K7L; Description: RES 78.7K OHM 1/10W 1% 0603 SMD; Power (Watts): 0.1W, 1/10W; Temperature Coefficient: ±100ppm/°C; Tolerance: ±1%; Supplier 1: Digi-Key; Supplier Part Number 1: 311-78.7KHRCT-ND; RoHS: RoHS Compliant; Category: Resistors; Stock 1: 134270; Pricing 1: 10=0.014, 50=0.0104, 100=0.0079, 250=0.00584, 500=0.00432, 1000=0.00288 (USD); Resistance (Ohms): 78.7K; Composition: Thick Film; Features: -; Size / Dimension: 0.063" L x 0.031" W (1.60mm x 0.80mm); Height: 0.018" (0.45mm); Number of Terminations: 2; Packaging: Cut Tape (CT); Package / Case: 0603 (1608 Metric); ComponentLink1URL: http://www.yageo.com/documents/recent/PYu-RC0603_51_RoHS_L_4.pdf; ComponentLink1Description: http://www.yageo.com/documents/recent/PYu-RC0603_51_RoHS_L_4.pdf
R43 R45 = RES_SM: resistor; Manufacturer: Yageo; Manufacturer Part Number: RC0603FR-0776K8L; Description: RES 76.8K OHM 1/10W 1% 0603 SMD; Power (Watts): 0.1W, 1/10W; Temperature Coefficient: ±100ppm/°C; Tolerance: ±1%; Supplier 1: Digi-Key; Supplier Part Number 1: 311-76.8KHRCT-ND; RoHS: RoHS Compliant; Category: Resistors; Stock 1: 91480; Pricing 1: 10=0.014, 50=0.0104, 100=0.0079, 250=0.00584, 500=0.00432, 1000=0.00288 (USD); Resistance (Ohms): 76.8K; Composition: Thick Film; Features: -; Size / Dimension: 0.063" L x 0.031" W (1.60mm x 0.80mm); Height: 0.018" (0.45mm); Number of Terminations: 2; Packaging: Cut Tape (CT); Package / Case: 0603 (1608 Metric); ComponentLink1URL: http://www.yageo.com/documents/recent/PYu-RC0603_51_RoHS_L_4.pdf; ComponentLink1Description: http://www.yageo.com/documents/recent/PYu-RC0603_51_RoHS_L_4.pdf
R44 R46 = RES_SM: resistor; Manufacturer: Yageo; Manufacturer Part Number: RC0603FR-07147KL; Description: RES 147K OHM 1/10W 1% 0603 SMD; Power (Watts): 0.1W, 1/10W; Temperature Coefficient: ±100ppm/°C; Tolerance: ±1%; Supplier 1: Digi-Key; Supplier Part Number 1: 311-147KHRCT-ND; RoHS: RoHS Compliant; Category: Resistors; Stock 1: 53540; Pricing 1: 10=0.014, 50=0.0104, 100=0.0079, 250=0.00584, 500=0.00432, 1000=0.00288 (USD); Resistance (Ohms): 147K; Composition: Thick Film; Features: -; Size / Dimension: 0.063" L x 0.031" W (1.60mm x 0.80mm); Height: 0.018" (0.45mm); Number of Terminations: 2; Packaging: Cut Tape (CT); Package / Case: 0603 (1608 Metric); ComponentLink1URL: http://www.yageo.com/documents/recent/PYu-RC0603_51_RoHS_L_4.pdf; ComponentLink1Description: http://www.yageo.com/documents/recent/PYu-RC0603_51_RoHS_L_4.pdf
R48 = RES_SM: resistor; Manufacturer: Yageo; Manufacturer Part Number: RC0603FR-07107KL; Description: RES 107K OHM 1/10W 1% 0603 SMD; Power (Watts): 0.1W, 1/10W; Temperature Coefficient: ±100ppm/°C; Tolerance: ±1%; Supplier 1: Digi-Key; Supplier Part Number 1: 311-107KHRCT-ND; RoHS: RoHS Compliant; Category: Resistors; Stock 1: 136570; Pricing 1: 10=0.014, 50=0.0104, 100=0.0079, 250=0.00584, 500=0.00432, 1000=0.00288 (USD); Resistance (Ohms): 107K; Composition: Thick Film; Features: -; Size / Dimension: 0.063" L x 0.031" W (1.60mm x 0.80mm); Height: 0.018" (0.45mm); Number of Terminations: 2; Packaging: Cut Tape (CT); Package / Case: 0603 (1608 Metric); ComponentLink1URL: http://www.yageo.com/documents/recent/PYu-RC0603_51_RoHS_L_4.pdf; ComponentLink1Description: http://www.yageo.com/documents/recent/PYu-RC0603_51_RoHS_L_4.pdf
R49 = RES_SM: resistor; Manufacturer: Yageo; Manufacturer Part Number: RC0603FR-0793K1L; Description: RES 93.1K OHM 1/10W 1% 0603 SMD; Power (Watts): 0.1W, 1/10W; Temperature Coefficient: ±100ppm/°C; Tolerance: ±1%; Supplier 1: Digi-Key; Supplier Part Number 1: 311-93.1KHRCT-ND; RoHS: RoHS Compliant; Category: Resistors; Stock 1: 109138; Pricing 1: 10=0.014, 50=0.0104, 100=0.0079, 250=0.00584, 500=0.00432, 1000=0.00288 (USD); Resistance (Ohms): 93.1K; Composition: Thick Film; Features: -; Size / Dimension: 0.063" L x 0.031" W (1.60mm x 0.80mm); Height: 0.018" (0.45mm); Number of Terminations: 2; Packaging: Cut Tape (CT); Package / Case: 0603 (1608 Metric); ComponentLink1URL: http://www.yageo.com/documents/recent/PYu-RC0603_51_RoHS_L_4.pdf; ComponentLink1Description: http://www.yageo.com/documents/recent/PYu-RC0603_51_RoHS_L_4.pdf
U15-U18 U20 = ADP3336: regulator; Manufacturer: Analog Devices Inc; Manufacturer Part Number: ADP3336ARMZ-REEL7; Description: IC REG LDO ADJ 500MA 8-MSOP; Regulator Topology: Positive Adjustable; Voltage - Output: 1.5 V ~ 10 V; Voltage - Input: 2.6 V ~ 12 V; Voltage - Dropout (Typical): 0.2V @ 500mA; Number of Regulators: 1; Current - Output: 500mA; Supplier 1: Digi-Key; Supplier Part Number 1: ADP3336ARMZ-REEL7CT-ND; RoHS: RoHS Compliant; Category: Integrated Circuits (ICs); Stock 1: 10613; Pricing 1: 1=3.22, 25=2.484, 100=2.254, 250=2.024, 500=1.748 (USD); Current - Limit (Min): -; Operating Temperature: -40°C ~ 85°C; Mounting Type: Surface Mount; Package / Case: 8-TSSOP, 8-MSOP (0.118", 3.00mm Width); Supplier Device Package: 8-MSOP; Packaging: Cut Tape (CT); ComponentLink1URL: http://www.analog.com/static/imported-files/data_sheets/ADP3336.pdf; ComponentLink1Description: http://www.analog.com/static/imported-files/data_sheets/ADP3336.pdf

## Sheet OK6010_DB_pwr_bgt.SchDoc
size A
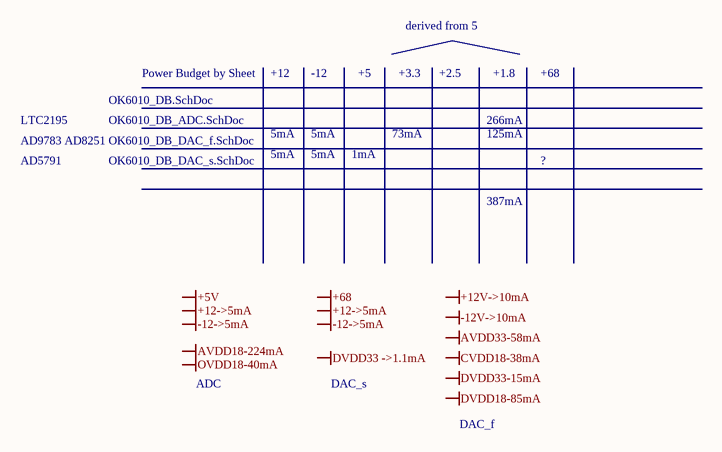
[diagram p5: OK6010_DB_pwr_bgt.SchDoc]

### Notes on the sheet
- Power Budget by Sheet
- +12
- -12
- +5
- +3.3
- derived from 5
- +2.5
- +1.8
- +68
- LTC2195
- OK6010_DB.SchDoc
- OK6010_DB_ADC.SchDoc
- 5mA
- 73mA
- 266mA
- 125mA
- AD9783 AD8251
- AD5791
- OK6010_DB_DAC_f.SchDoc
- OK6010_DB_DAC_s.SchDoc
- 1mA
- 387mA
- ?
- ADC
- DAC_s
- DAC_f
- Labels drawn without touching a wire or pin: +5V, +12->5mA, +12V->10mA, +68, -12->5mA, -12V->10mA, AVDD18-224mA, AVDD33-58mA, CVDD18-38mA, DVDD18-85mA, DVDD33 ->1.1mA, DVDD33-15mA, OVDD18-40mA

## Nets that join several sheets
+5: OK6010_DB_ADC (9 pins), OK6010_DB_PWR (C59.1 L8.2)
+12: OK6010_DB_ADC (C89.1 C92.1 U2.8 U4.8), OK6010_DB_DAC_s (13 pins), OK6010_DB_DAC_f (C42.2 C45.2 U13.8 U14.8), OK6010_DB_PWR (C61.1 C98.1 L10.2 L26.2)
+68: OK6010_DB_DAC_s (C26.1 C27.1 U11.5), OK6010_DB_PWR (JP4.1)
-12: OK6010_DB_ADC (C88.1 C91.1 U2.3 U4.3), OK6010_DB_DAC_s (13 pins), OK6010_DB_DAC_f (C41.2 C44.2 U13.3 U14.3), OK6010_DB_PWR (C63.2 C104.2 L12.2 L28.2)
AGND: OK6010_DB (53 pins), OK6010_DB_ADC (47 pins), OK6010_DB_DAC_s (33 pins), OK6010_DB_DAC_f (36 pins), OK6010_DB_PWR (45 pins)
AVDD18: OK6010_DB_ADC (6 pins), OK6010_DB_PWR (C69.1 L16.2)
AVDD33: OK6010_DB_DAC_f (6 pins), OK6010_DB_PWR (6 pins)
CVDD18: OK6010_DB_DAC_f (5 pins), OK6010_DB_PWR (C66.1 L14.2)
DVDD18: OK6010_DB_DAC_f (C79.2 C80.2 U12.8 U12.47), OK6010_DB_PWR (C71.1 L18.2)
DVDD25: OK6010_DB (JP3_B.36 JP3_B.56), OK6010_DB_DAC_s (C103.1 U10.10), OK6010_DB_PWR (6 pins)
DVDD33: OK6010_DB_DAC_s (C21.1 C22.1 U10.9), OK6010_DB_DAC_f (C77.1 R50.2 R51.2 U12.27), OK6010_DB_PWR (6 pins)
OVDD18: OK6010_DB_ADC (C50.2 U1.34), OK6010_DB_PWR (C84.1 L22.2)
A0_IN: OK6010_DB (JP2_B.17), OK6010_DB_ADC (R53.1 U2.5 U4.5)
A0_OUT: OK6010_DB (JP2_B.47), OK6010_DB_DAC_f (R51.1 U13.5 U14.5)
A1_IN: OK6010_DB (JP2_B.15), OK6010_DB_ADC (R52.1 U2.4 U4.4)
A1_OUT: OK6010_DB (JP2_B.37), OK6010_DB_DAC_f (R50.1 U13.4 U14.4)
ADC_CS: OK6010_DB (JP2_B.45), OK6010_DB_ADC (U1.19)
ADC_SCK: OK6010_DB (JP2_B.43), OK6010_DB_ADC (U1.20)
ADC_SDI: OK6010_DB (JP2_B.41), OK6010_DB_ADC (U1.21)
ADC_SDO: OK6010_DB (JP2_B.16), OK6010_DB_ADC (U1.46)
~{CLR}: OK6010_DB (JP3_B.26), OK6010_DB_DAC_s (U10.7)
CSB: OK6010_DB (JP2_B.29), OK6010_DB_DAC_f (U12.52)
L1_0_N: OK6010_DB (JP3_B.51), OK6010_DB_DAC_f (U12.24)
L1_0_P: OK6010_DB (JP3_B.49), OK6010_DB_DAC_f (U12.23)
L2_0_N: OK6010_DB (JP3_B.25), OK6010_DB_DAC_f (C38.1)
L2_0_P: OK6010_DB (JP3_B.23), OK6010_DB_DAC_f (C37.1)
L3_0_N: OK6010_DB (JP3_B.47), OK6010_DB_DAC_f (U12.18)
L3_0_P: OK6010_DB (JP3_B.45), OK6010_DB_DAC_f (U12.17)
L4_0_N: OK6010_DB (JP3_B.52), OK6010_DB_DAC_f (U12.30)
L4_0_P: OK6010_DB (JP3_B.50), OK6010_DB_DAC_f (U12.29)
L5_0_N: OK6010_DB (JP3_B.58), OK6010_DB_DAC_f (U12.34)
L5_0_P: OK6010_DB (JP3_B.54), OK6010_DB_DAC_f (U12.33)
L6_0_N: OK6010_DB (JP3_B.57), OK6010_DB_DAC_f (U12.32)
L6_0_P: OK6010_DB (JP3_B.53), OK6010_DB_DAC_f (U12.31)
L7_0_N: OK6010_DB (JP3_B.34), OK6010_DB_DAC_f (U12.16)
L7_0_P: OK6010_DB (JP3_B.32), OK6010_DB_DAC_f (U12.15)
L8_0_N: OK6010_DB (JP3_B.62), OK6010_DB_DAC_f (U12.36)
L8_0_P: OK6010_DB (JP3_B.60), OK6010_DB_DAC_f (U12.35)
L29_1_N: OK6010_DB (JP2_B.26), OK6010_DB_ADC (U1.41)
L29_1_P: OK6010_DB (JP2_B.24), OK6010_DB_ADC (U1.42)
L30_1_N: OK6010_DB (JP2_B.30), OK6010_DB_ADC (U1.39)
L30_1_P: OK6010_DB (JP2_B.28), OK6010_DB_ADC (U1.40)
L32_0_N: OK6010_DB (JP3_B.39), OK6010_DB_DAC_f (U12.14)
L32_0_P: OK6010_DB (JP3_B.37), OK6010_DB_DAC_f (U12.13)
L33_0_N: OK6010_DB (JP3_B.40), OK6010_DB_DAC_f (U12.20)
L33_0_P: OK6010_DB (JP3_B.38), OK6010_DB_DAC_f (U12.19)
L36_0_N: OK6010_DB (JP3_B.44), OK6010_DB_DAC_f (U12.22)
L36_0_P: OK6010_DB (JP3_B.42), OK6010_DB_DAC_f (U12.21)
L38_0_N: OK6010_DB (JP3_B.65), OK6010_DB_DAC_f (U12.38)
L38_0_P: OK6010_DB (JP3_B.63), OK6010_DB_DAC_f (U12.37)
L38_1_N: OK6010_DB (JP2_B.22), OK6010_DB_ADC (U1.43)
L38_1_P: OK6010_DB (JP2_B.20), OK6010_DB_ADC (U1.44)
L39_1_N: OK6010_DB (JP2_B.66), OK6010_DB_ADC (U1.23)
L39_1_P: OK6010_DB (JP2_B.64), OK6010_DB_ADC (U1.24)
L40_1_N: OK6010_DB (JP2_B.40), OK6010_DB_ADC (U1.35)
L40_1_P: OK6010_DB (JP2_B.38), OK6010_DB_ADC (U1.36)
L44_1_N: OK6010_DB (JP2_B.62), OK6010_DB_ADC (U1.25)
L44_1_P: OK6010_DB (JP2_B.60), OK6010_DB_ADC (U1.26)
L47_1_N: OK6010_DB (JP2_B.52), OK6010_DB_ADC (U1.27)
L47_1_P: OK6010_DB (JP2_B.50), OK6010_DB_ADC (U1.28)
L49_0_N: OK6010_DB (JP3_B.29), OK6010_DB_DAC_f (U12.10)
L49_0_P: OK6010_DB (JP3_B.27), OK6010_DB_DAC_f (U12.9)
L49_1_N: OK6010_DB (JP2_B.48), OK6010_DB_ADC (U1.29)
L49_1_P: OK6010_DB (JP2_B.46), OK6010_DB_ADC (U1.30)
L50_0_N: OK6010_DB (JP3_B.70), OK6010_DB_DAC_f (U12.40)
L50_0_P: OK6010_DB (JP3_B.68), OK6010_DB_DAC_f (U12.39)
L51_0_N: OK6010_DB (JP3_B.69), OK6010_DB_DAC_f (U12.42)
L51_0_P: OK6010_DB (JP3_B.67), OK6010_DB_DAC_f (U12.41)
L51_1_N: OK6010_DB (JP2_B.44), OK6010_DB_ADC (U1.31)
L51_1_P: OK6010_DB (JP2_B.42), OK6010_DB_ADC (U1.32)
L58_1_N: OK6010_DB (JP2_B.34), OK6010_DB_ADC (U1.37)
L58_1_P: OK6010_DB (JP2_B.32), OK6010_DB_ADC (U1.38)
L62_0_N: OK6010_DB (JP3_B.48), OK6010_DB_DAC_f (U12.26)
L62_0_P: OK6010_DB (JP3_B.46), OK6010_DB_DAC_f (U12.25)
L63_0_N: OK6010_DB (JP3_B.74), OK6010_DB_DAC_f (U12.44)
L63_0_P: OK6010_DB (JP3_B.72), OK6010_DB_DAC_f (U12.43)
L64_0_N: OK6010_DB (JP3_B.73), OK6010_DB_DAC_f (U12.46)
L64_0_P: OK6010_DB (JP3_B.71), OK6010_DB_DAC_f (U12.45)
L65_0_N: OK6010_DB (JP3_B.75), OK6010_DB_ADC (C7.2)
L65_0_P: OK6010_DB (JP3_B.76), OK6010_DB_ADC (C5.2)
L66_0_N: OK6010_DB (JP3_B.33), OK6010_DB_DAC_f (U12.12)
L66_0_P: OK6010_DB (JP3_B.31), OK6010_DB_DAC_f (U12.11)
~{LDAC}: OK6010_DB (JP3_B.28), OK6010_DB_DAC_s (U10.8)
~{RESET}: OK6010_DB (JP3_B.24), OK6010_DB_DAC_s (U10.6)
RESET: OK6010_DB (JP2_B.31), OK6010_DB_DAC_f (U12.53)
~{SYNC}: OK6010_DB (JP3_B.16), OK6010_DB_DAC_s (U10.14)
SCLK: OK6010_DB (JP3_B.18), OK6010_DB_DAC_s (U10.13)
SCLK2: OK6010_DB (JP2_B.27), OK6010_DB_DAC_f (U12.51)
SDIN: OK6010_DB (JP3_B.20), OK6010_DB_DAC_s (U10.12)
SDIO: OK6010_DB (JP2_B.25), OK6010_DB_DAC_f (U12.50)
SDO: OK6010_DB (JP3_B.22), OK6010_DB_DAC_s (U10.11)
SDO2: OK6010_DB (JP2_B.23), OK6010_DB_DAC_f (U12.49)
WR1_IN: OK6010_DB (JP2_B.19), OK6010_DB_ADC (U2.6)
WR1_OUT: OK6010_DB (JP2_B.49), OK6010_DB_DAC_f (U14.6)
WR2_IN: OK6010_DB (JP2_B.21), OK6010_DB_ADC (U4.6)
WR2_OUT: OK6010_DB (JP2_B.33), OK6010_DB_DAC_f (U13.6)